# Altium schematic sheet RAM.SchDoc
size A
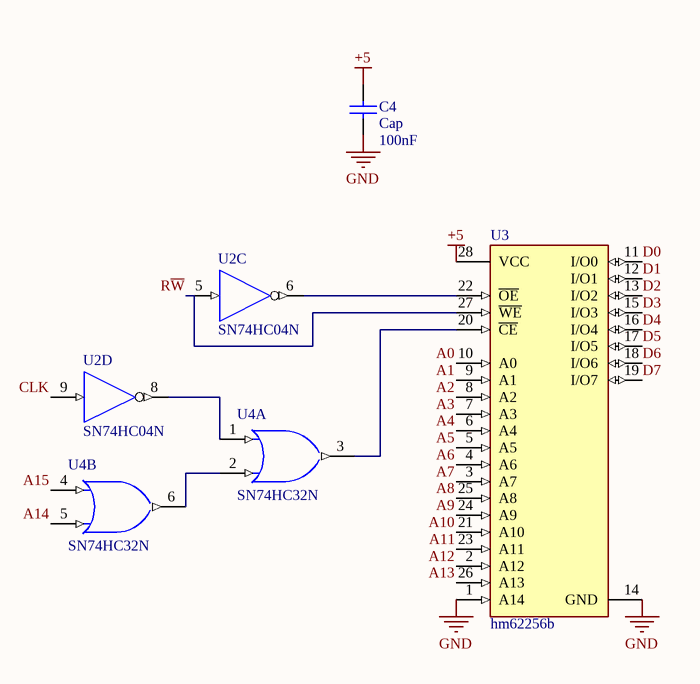
[diagram p0: RAM.SchDoc]

## Parts
C4  Cap  value 100nF  [Ceramic Capacitor]
U2  SN74HC04N  [N0014A]  (parts C,D of 7)
U3  hm62256b  [FP-28P6-MFG]
U4  SN74HC32N  [N0014A]  (parts A,B of 5)

## Nets
+5: C4.1 U3.28(VCC)
GND: C4.2 U3.1(A14) U3.14(GND)
A0: U3.10(A0)
A1: U3.9(A1)
A2: U3.8(A2)
A3: U3.7(A3)
A4: U3.6(A4)
A5: U3.5(A5)
A6: U3.4(A6)
A7: U3.3(A7)
A8: U3.25(A8)
A9: U3.24(A9)
A10: U3.21(A10)
A11: U3.23(A11)
A12: U3.2(A12)
A13: U3.26(A13)
A14: U4.5(2B)
A15: U4.4(2A)
CLK: U2.9(4A)
D0: U3.11(I/O0)
D1: U3.12(I/O1)
D2: U3.13(I/O2)
D3: U3.15(I/O3)
D4: U3.16(I/O4)
D5: U3.17(I/O5)
D6: U3.18(I/O6)
D7: U3.19(I/O7)
R~{W}: U2.5(3A) U3.27(~{WE})
NetU2_6: U2.6(~{3Y}) U3.22(~{OE})
NetU2_8: U2.8(~{4Y}) U4.1(1A)
NetU3_20: U3.20(~{CE}) U4.3(1Y)
NetU4_2: U4.2(1B) U4.6(2Y)

## Library data of the parts
C4 = Cap: Capacitor; Published: 8-Jun-2000; LatestRevisionDate: 17-Jul-2002; LatestRevisionNote: Re-released for DXP Platform.; PackageReference: RAD-0.3; Publisher: Altium Limited; PackageDescription: Radial Cap, Thru-Hole; 2 Leads; 0.3 in Pin Spacing
U2 = CMP-1615-00892-2: Hex Inverters, N0014A, TUBE; Manufacturer: Texas Instruments; VCC(Min)(V): 2; Bits(#): 6; Technology Family: HC; tpd @ Nom Voltage(Max)(ns): 20; Output Drive (IOL/IOH)(Max)(mA): -4/4; Rating: Catalog; Voltage(Nom)(V): 5; Schmitt Trigger: No; ICC @ Nom Voltage(Max)(mA): 0.02; Input Type: CMOS; Code_JEDEC: MS-001; PackageReference: N0014A; DatasheetVersion: SCLS078F; Output Type: CMOS; VCC(Max)(V): 6; Operating Temperature Range(C): -40 to 85; Generic Part Number: SN74HC04; F @ Nom Voltage(Max)(Mhz): 20
U3 = CMP-06313-000003-1: RAM; Manufacturer Part Number: AT28C256-15PU; Manufacturer: Microchip; Max Supply Voltage: 5.5V; Memory Type: EEPROM; Interface: Parallel; Nominal Supply Current: 50mA; Memory Size: 256Kbits; Access Time: 150ns; Min Supply Voltage: 4.5V; Standoff Height: 0.381mm; Digikey Description: IC EEPROM 256K PARALLEL 28DIP; Device Class L3: EEPROM; Temperature: -40°C to +85°C; RoHS: TRUE; Device Class L1: Integrated Circuits (ICs); ComponentLink2Description: Datasheet; Package: 28P6; Device Class L2: Memory; ComponentLink2URL: http://ww1.microchip.com/downloads/en/DeviceDoc/doc0006.pdf; Temperature Range Low: -40°C; Category: IC; Lead Free: Yes; Automotive: No; Ipc Land Pattern Name: DIP1556W46P254L3734H483Q28; Height: 4.826mm; Octopart: https://octopart.com/at28c256-15pu-microchip-77758240; Temperature Range High: +85°C
U4 = CMP-1573-00148-3: Quadruple 2-Input Positive-OR Gates, N0014A, TUBE; Manufacturer: Texas Instruments; Output Type: CMOS; Rating: Catalog; ICC @ Nom Voltage(Max)(mA): 0.02; VCC(Min)(V): 2; VCC(Max)(V): 6; Bits(#): 4; tpd @ Nom Voltage(Max)(ns): 25; Voltage(Nom)(V): 5; F @ Nom Voltage(Max)(Mhz): 70; Output Drive (IOL/IOH)(Max)(mA): 5.2/-5.2; PackageVersion: http://www.ti.com/lit/ml/mpdi002c/mpdi002c.pdf; Operating Temperature Range(C): -40 to 85; Code_JEDEC: MS-001; DatasheetVersion: SCLS200D; Generic Part Number: SN74HC32; Input Type: CMOS; PackageReference: N0014A